# Altium schematic sheet doan2.SchDoc
size A
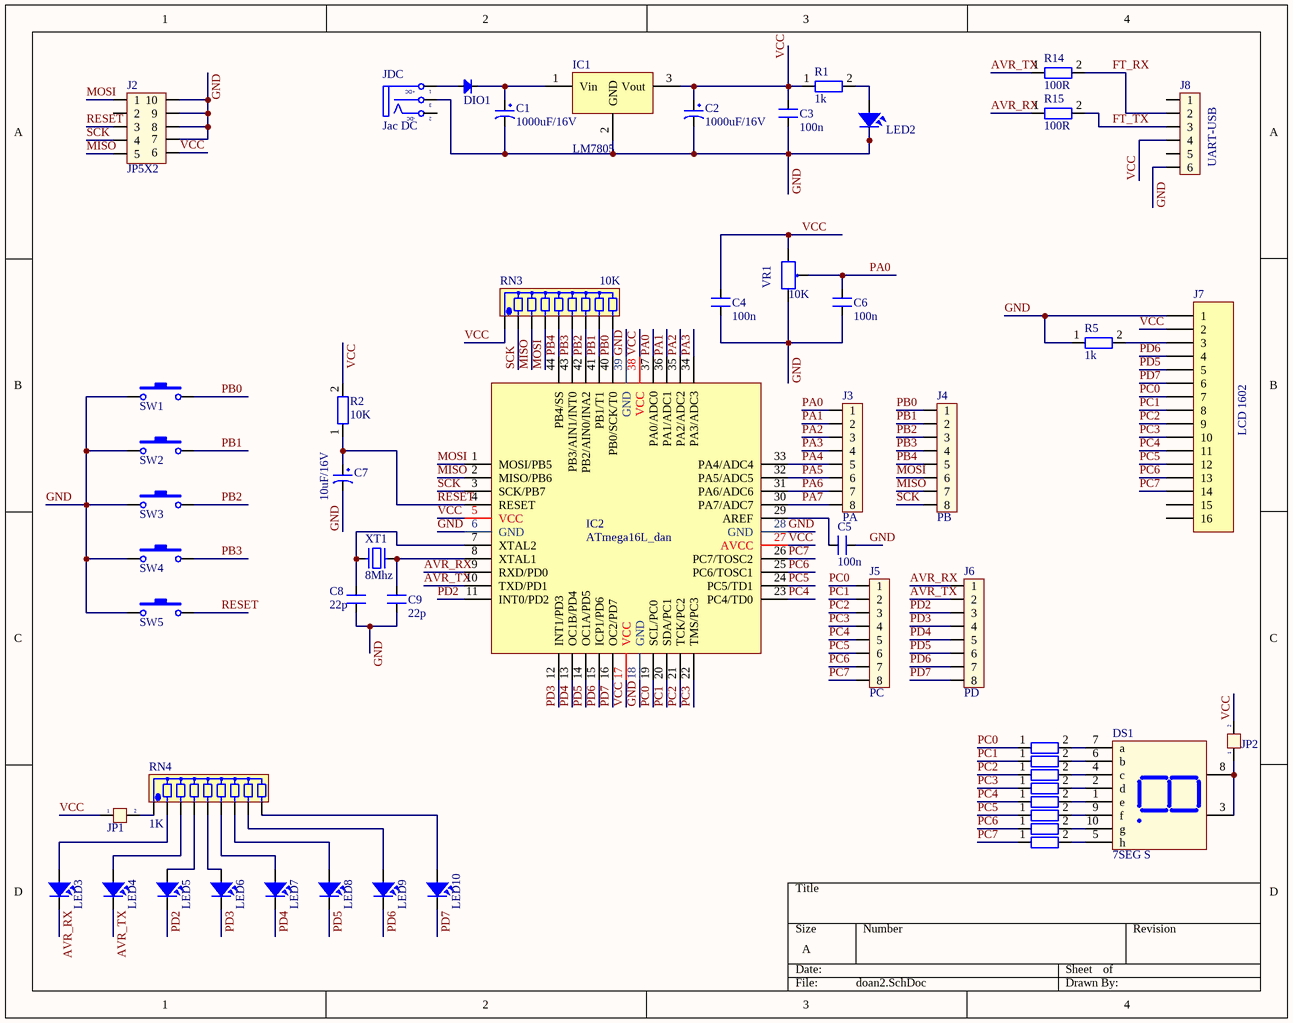
[diagram p0: doan2.SchDoc]

## Parts
C1  1000uF/16V  [CAP1000uf/25V]
C2  1000uF/16V  [CAP1000uf/25V]
C3  100n  [SM-CAP-0805]
C4  100n  [SM-CAP-0805]
C5  100n  [SM-CAP-0805]
C6  100n  [SM-CAP-0805]
C7  10uF/16V  [CAP10uf/16V]
C8  22p  [SM-CAP-0805]
C9  22p  [SM-CAP-0805]
DIO1  Diode  [DIO-SMD-106]  (value not drawn)
DS1  7SEG S  [7SEGS]
IC1  LM7805  [LM7805/DPAK]
IC2  ATmega16L_dan  [DIP44/W0.6]
J2  JP5X2  [JP5X2]
J3  PA  [JP8]
J4  PB  [JP8]
J5  PC  [JP8]
J6  PD  [JP8]
J7  LCD 1602  [JP16-C1T]
J8  UART-USB  [JP6]
JDC  Jac DC  [DC-IN]
JP1  Jumper 2  [JP2]  (value not drawn)
JP2  Jumper 2  [JP2]  (value not drawn)
LED2  LED SMD  [SM-LED-0805-Green - duplicate]  (value not drawn)
LED3  LED SMD  [SM-LED-0805-Green - duplicate]  (value not drawn)
LED4  LED SMD  [SM-LED-0805-Green - duplicate]  (value not drawn)
LED5  LED SMD  [SM-LED-0805-Green - duplicate]  (value not drawn)
LED6  LED SMD  [SM-LED-0805-Green - duplicate]  (value not drawn)
LED7  LED SMD  [SM-LED-0805-Green - duplicate]  (value not drawn)
LED8  LED SMD  [SM-LED-0805-Green - duplicate]  (value not drawn)
LED9  LED SMD  [SM-LED-0805-Green - duplicate]  (value not drawn)
LED10  LED SMD  [SM-LED-0805-Green - duplicate]  (value not drawn)
R1  1k  [SM-RES-0805]
R2  10K  [SM-RES-0805]
R5  1k  [SM-RES-0805]
R6  1k  [SM-RES-0805]  (value not drawn)
R7  1k  [SM-RES-0805]  (value not drawn)
R8  1k  [SM-RES-0805]  (value not drawn)
R9  1k  [SM-RES-0805]  (value not drawn)
R10  1k  [SM-RES-0805]  (value not drawn)
R11  1k  [SM-RES-0805]  (value not drawn)
R12  1k  [SM-RES-0805]  (value not drawn)
R13  1k  [SM-RES-0805]  (value not drawn)
R14  100R  [SM-RES-0805]
R15  100R  [SM-RES-0805]
RN3  10K  [RN8]
RN4  1K  [RN8]
SW1  SW-SMD  [SW-SMD]  (value not drawn)
SW2  SW-SMD  [SW-SMD]  (value not drawn)
SW3  SW-SMD  [SW-SMD]  (value not drawn)
SW4  SW-SMD  [SW-SMD]  (value not drawn)
SW5  RESET  [SW-SMD]  (value not drawn)
VR1  10K  [VR]
XT1  8Mhz  [XT2]

## Nets
AVR_RX: IC2.9(RXD/PD0) J6.1 LED3.2 R15.1
AVR_TX: IC2.10(TXD/PD1) J6.2 LED4.2 R14.1
FT_RX: J8.2 R14.2
FT_TX: J8.3 R15.2
GND: C1.2 C2.2 C3.1 C4.1 C5.1 C6.1 C7.2 C8.1 C9.1 IC1.2(GND) IC2.6(GND) IC2.18(GND) IC2.28(GND) IC2.39(GND) J2.7 J2.8 J2.9 J2.10 J7.1 J8.6 JDC.3(S) LED2.2 R5.1 SW1.1 SW2.1 SW3.1 SW4.1 SW5.1 VR1.3
MISO: IC2.2(MISO/PB6) J2.5 J4.7 RN3.3
MOSI: IC2.1(MOSI/PB5) J2.1 J4.6 RN3.4
PA0: C6.2 IC2.37(PA0/ADC0) J3.1 VR1.2
PA1: IC2.36(PA1/ADC1) J3.2
PA2: IC2.35(PA2/ADC2) J3.3
PA3: IC2.34(PA3/ADC3) J3.4
PA4: IC2.33(PA4/ADC4) J3.5
PA5: IC2.32(PA5/ADC5) J3.6
PA6: IC2.31(PA6/ADC6) J3.7
PA7: IC2.30(PA7/ADC7) J3.8
PB0: IC2.40(PB0/SCK/T0) J4.1 RN3.9 SW1.2
PB1: IC2.41(PB1/T1) J4.2 RN3.8 SW2.2
PB2: IC2.42(PB2/AIN0/INA2) J4.3 RN3.7 SW3.2
PB3: IC2.43(PB3/AIN1/INT0) J4.4 RN3.6 SW4.2
PB4: IC2.44(PB4/SS) J4.5 RN3.5
PC0: IC2.19(SCL/PC0) J5.1 J7.7 R6.1
PC1: IC2.20(SDA/PC1) J5.2 J7.8 R7.1
PC2: IC2.21(TCK/PC2) J5.3 J7.9 R8.1
PC3: IC2.22(TMS/PC3) J5.4 J7.10 R9.1
PC4: IC2.23(PC4/TD0) J5.5 J7.11 R10.1
PC5: IC2.24(PC5/TD1) J5.6 J7.12 R11.1
PC6: IC2.25(PC6/TOSC1) J5.7 J7.13 R12.1
PC7: IC2.26(PC7/TOSC2) J5.8 J7.14 R13.1
PD2: IC2.11(INT0/PD2) J6.3 LED5.2
PD3: IC2.12(INT1/PD3) J6.4 LED6.2
PD4: IC2.13(OC1B/PD4) J6.5 LED7.2
PD5: IC2.14(OC1A/PD5) J6.6 J7.5 LED8.2
PD6: IC2.15(ICP1/PD6) J6.7 J7.4 LED9.2
PD7: IC2.16(OC2/PD7) J6.8 J7.6 LED10.2
RESET: C7.1 IC2.4(RESET) J2.3 R2.1 SW5.2
SCK: IC2.3(SCK/PB7) J2.4 J4.8 RN3.2
VCC: C2.1 C3.2 C4.2 IC1.3(Vout) IC2.5(VCC) IC2.17(VCC) IC2.27(AVCC) IC2.38(VCC) J2.6 J7.2 J8.4 JP1.1 JP2.2 R1.1 R2.2 RN3.1 VR1.1
NetC1_1: C1.1 DIO1.2(K) IC1.1(Vin)
NetC5_2: C5.2 IC2.29(AREF)
NetC8_2: C8.2 IC2.7(XTAL2) XT1.2
NetC9_2: C9.2 IC2.8(XTAL1) XT1.1
NetDIO1_1: DIO1.1(A) JDC.1(T)
NetDS1_1: DS1.1(e) R10.2
NetDS1_2: DS1.2(d) R9.2
NetDS1_3: DS1.3(Vcc) DS1.8(Vcc) JP2.1
NetDS1_4: DS1.4(c) R8.2
NetDS1_5: DS1.5(h) R13.2
NetDS1_6: DS1.6(b) R7.2
NetDS1_7: DS1.7(a) R6.2
NetDS1_9: DS1.9(f) R11.2
NetDS1_10: DS1.10(g) R12.2
NetJ7_3: J7.3 R5.2
NetJP1_2: JP1.2 RN4.1
NetLED2_1: LED2.1 R1.2
NetLED3_1: LED3.1 RN4.2
NetLED4_1: LED4.1 RN4.3
NetLED5_1: LED5.1 RN4.4
NetLED6_1: LED6.1 RN4.5
NetLED7_1: LED7.1 RN4.6
NetLED8_1: LED8.1 RN4.7
NetLED9_1: LED9.1 RN4.8
NetLED10_1: LED10.1 RN4.9

Not connected (* = marked no-connect by the designer): J2 2; J7 15 16; J8 1 5; JDC 2(TN)

## Notes on the sheet
- (in symbol DCIN) +DC; -DC

## Library data of the parts
C1 C2 = CAP1000uf/25V: Cap 1000uF/16V - 220uF/50V; Description 5: 4,7uF>10uF/250V_3,3uF>10uF/400V - 2,2uF>4,7uF/450V; Description 1: 2200uF-3300uF/6,3V - 1000uF-2200uF/10V; Description 2: 1000uF/16V - 470uF => 1000uF/25V - 100uF/100V; Description 3: 330uF>470uF/35V_220uF>470uF/50V_10uF>22uF/250V; Description 4: 220uF => 330uF/63V - 10uF =>33uF/160 - 200V; Value: 1000uF/16V
C3-C6 C8 C9 = CN: Value: 0,1uF/300V; Designed by: VanDungEvn
C7 = CAP10uf/16V: Cap 1000uF/16V - 220uF/50V; Description 5: 4,7uF>10uF/250V_3,3uF>10uF/400V - 2,2uF>4,7uF/450V; Description 1: 2200uF-3300uF/6,3V - 1000uF-2200uF/10V; Description 2: 1000uF/16V - 470uF => 1000uF/25V - 100uF/100V; Description 3: 330uF>470uF/35V_220uF>470uF/50V_10uF>22uF/250V; Description 4: 220uF => 330uF/63V - 10uF =>33uF/160 - 200V; Value: 1000uF/16V
DIO1 = Diode: Default Diode; Code - JEDEC: DO-214-AB; Value: 1N5007; Published: 8-Jun-2000; Revision: July-2002: Re-released for DXP Platform.; Publisher: Altium Limited
DS1 = LED7S: Single 7 Seg Dipslay; Value: LED 7S SEG
J3-J6 = JP8: JP8 PIN; Value: JP7
J7 = JP16: WR-PHD 2.54 mm Angled Socket Header; Manufacturer: W¨¹rth Elektronik eiSos GmbH; partNo: 613016143121; ComponentLink1 Description: Manufacturer; ComponentLink2 Description: Datasheet; NoPins: 16; Created Date: 29 March 2013; ComponentLink1URL: http://www.we-online.com; ComponentLink2URL: http://katalog.we-online.de/em/datasheet/6130xx143121.pdf; Created by: Karrer Zheng
J8 = JP6: JP6 PIN; Value: JP7
JDC = DCIN: Jac DC input; Value: Jac DC
JP1 JP2 = JP 2: Value: JP 2
LED2-LED10 = LED-SMD-0805
R1 R2 R5-R15 = R1/4W: Resistor 1/4W; Value: R1/4W - 1K
RN3 RN4 = RN8: Resistor 8 (Thanh); Value: Tro thanh 10K
SW1-SW5 = SW-SMD: Switch; Published: 24-Mar-1999; LatestRevisionDate: 17-Jul-2002; LatestRevisionNote: Re-released for DXP Platform.; PackageReference: SPST-2; Publisher: Altium Limited
VR1 = VR: Var Resistor; Value: VR 10K
XT1 = XT2: Crystal For all Crystal 2pin.; Value: 4Mhz